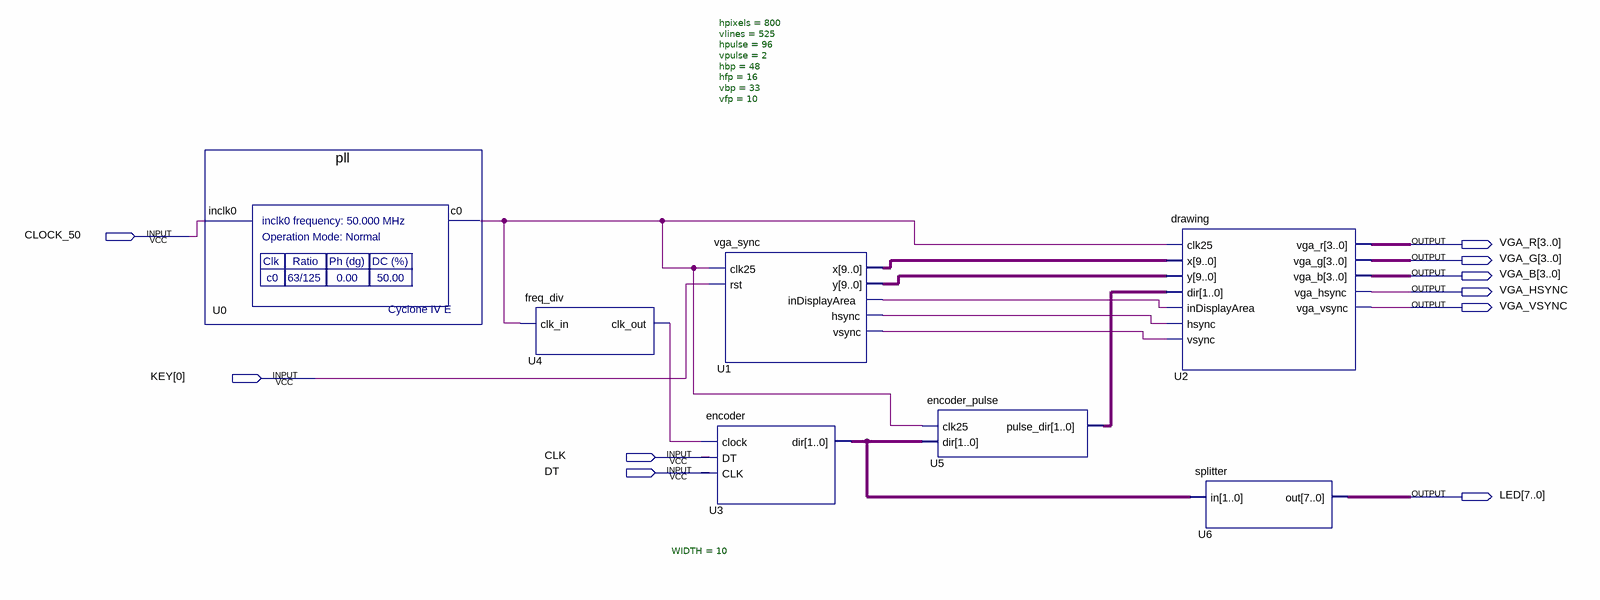
[diagram p0: schematic sheet]
// Quartus schematic Block_main.bdf as structural Verilog: 7 symbols, 10 pins
module Block_main (
  input  CLOCK_50,
  input  [0:0] KEY,
  input  CLK,
  input  DT,
  output [3:0] VGA_R,
  output [3:0] VGA_G,
  output [3:0] VGA_B,
  output VGA_HSYNC,
  output VGA_VSYNC,
  output [7:0] LED
);

  wire U0_c0, U1_hsync, U1_indisplayarea, U1_vsync, U4_clk_out;
  wire [1:0] U3_dir, U5_pulse_dir;
  wire [9:0] U1_x, U1_y;

  pll U0 (.inclk0(CLOCK_50), .c0(U0_c0));
  freq_div U4 (.clk_in(U0_c0), .clk_out(U4_clk_out));
  vga_sync #(.hpixels(800), .vlines(525), .hpulse(96), .vpulse(2), .hbp(48), .hfp(16), .vbp(33), .vfp(10)) U1 (
    .clk25(U0_c0), .rst(KEY[0]), .x(U1_x), .y(U1_y), .inDisplayArea(U1_indisplayarea), .hsync(U1_hsync),
    .vsync(U1_vsync));
  encoder #(.WIDTH(10)) U3 (.clock(U4_clk_out), .DT(CLK), .CLK(DT), .dir(U3_dir));
  encoder_pulse U5 (.clk25(U0_c0), .dir(U3_dir), .pulse_dir(U5_pulse_dir));
  drawing U2 (
    .clk25(U0_c0), .x(U1_x), .y(U1_y), .dir(U5_pulse_dir), .inDisplayArea(U1_indisplayarea),
    .hsync(U1_hsync), .vsync(U1_vsync), .vga_r(VGA_R), .vga_g(VGA_G), .vga_b(VGA_B), .vga_hsync(VGA_HSYNC),
    .vga_vsync(VGA_VSYNC));
  splitter U6 (.in(U3_dir), .out(LED));
endmodule
